# EasyEDA schematic 1-Schematic_RGB project.json
TITLE: Sheet_1; REV: 1.0; Date: 2021-05-16; Sheet: 1/1; Drawn By: saravanan pushpakumar; Company: Your Company
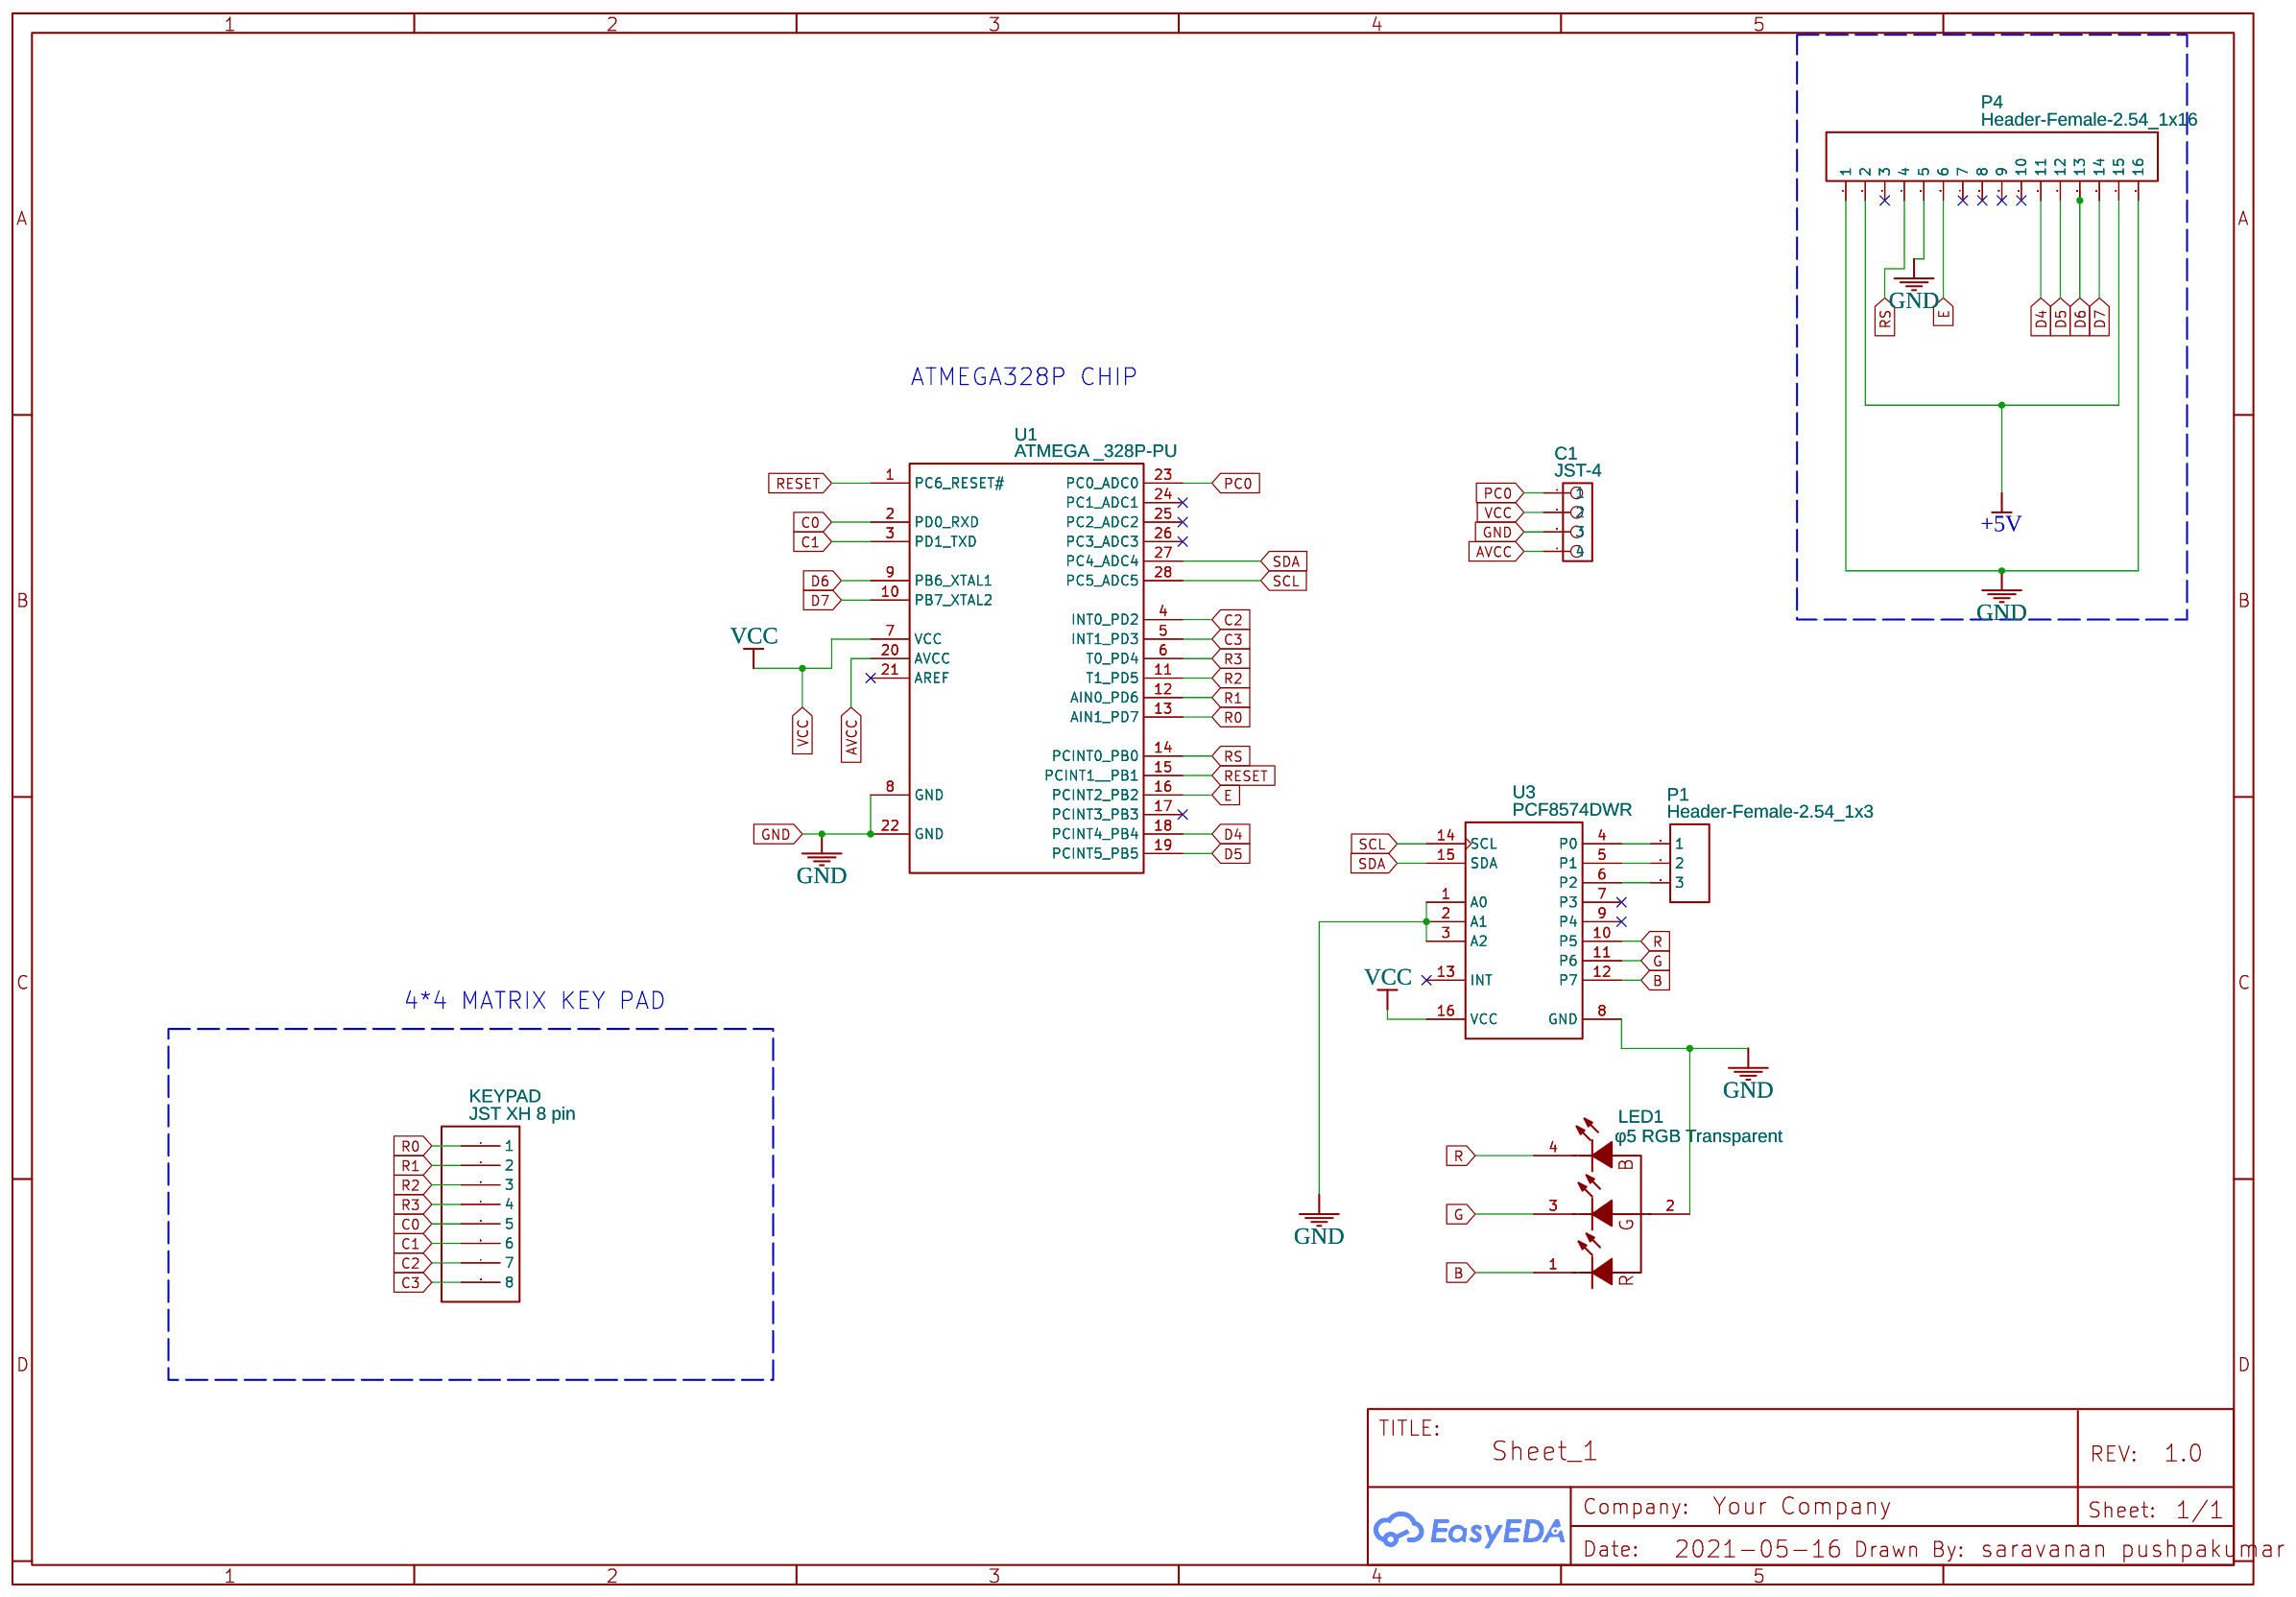
[diagram p0: schematic sheet]

## Parts
C1  JST-4  [JST-4-FEMALE]
KEYPAD  JST XH 8 pin  [JST XH 8]
LED1  φ5 RGB Transparent  [LED-TH_4P-BD5.8-P1.30]
P1  Header-Female-2.54_1x3  [HDR-TH_3P-P2.54-V-F]
P4  Header-Female-2.54_1x16  [HDR-TH_16P-P2.54-V]
U1  ATMEGA _328P-PU  [DIP-28_L34.6-W7.3-P2.54-LS10.2-BL]
U3  PCF8574DWR  [DW16_N]

## Library data of the parts
C1 = JST-4: Manufacturer Part: XH-4A; Supplier Part: XH-4A; Supplier: EasyEDA; Contributor: Beddekhoes dekbedhoes; DataSheet: http://www.jst-mfg.com/product/pdf/eng/eXH.pdf; link: http://www.jst-mfg.com/product/pdf/eng/eXH.pdf
KEYPAD = JST XH 8 pin: Supplier Part: undefined; Contributor: HenryPenton
LED1 = φ5 RGB Transparent: Supplier: LCSC; Manufacturer: KENTO; Manufacturer Part: φ5 RGB Transparent LED; Contributor: LCSC; Supplier Part: C32985
P1 = Header-Female-2.54_1x3: Supplier Part: C146243; Supplier: LCSC; Manufacturer: Boom Precision Elec; link: https://datasheet.lcsc.com/szlcsc/Boom-Precision-Elec-2-54mm-1-8P-Straight-Female-header_C27438.pdf; JLCPCB Part Class: Extended Part
P4 = Header-Female-2.54_1x16: Supplier: LCSC; Manufacturer: BOOMELE; Manufacturer Part: Female header1*16P pitch 2.54mm; image: //image.lceda.cn/szlcsc/C66987.jpg; Supplier Part: C66987; JLCPCB Part Class: Extended Part
U1 = ATMEGA _328P-PU: sourceId: Oic6oiASL; Supplier: LCSC; Manufacturer: MICROCHIP; Manufacturer Part: ATMEGA328P-PU; image: //image.lceda.cn/szlcsc/C33901.jpg; Contributor: LCSC; Supplier Part: C33901
U3 = PCF8574DWR: Remote 8-Bit IO Expander for I2C-Bus, 2.5 to 6 V, -40 to 85 degC, 16-pin SOIC (DW), Green (RoHS  no SbBr)

## Nets
+5V: P4.2 P4.15
AVCC: C1.4 U1.20(AVCC)
GND: C1.3 LED1.2(CA) P4.1 P4.5 P4.16 U1.8(GND) U1.22(GND) U3.1(A0) U3.2(A1) U3.3(A2) U3.8(GND)
VCC: C1.2 U1.7(VCC) U3.16(VCC)
B: LED1.1(KR) U3.12(P7)
C0: KEYPAD.5 U1.2(PD0 RXD)
C1: KEYPAD.6 U1.3(PD1 TXD)
C2: KEYPAD.7 U1.4(INT0 PD2)
C3: KEYPAD.8 U1.5(INT1 PD3)
D4: P4.11 U1.18(PCINT4 PB4)
D5: P4.12 U1.19(PCINT5 PB5)
D6: P4.13 U1.9(PB6 XTAL1)
D7: P4.14 U1.10(PB7 XTAL2)
E: P4.6 U1.16(PCINT2 PB2)
G: LED1.3(KG) U3.11(P6)
PC0: C1.1 U1.23(PC0 ADC0)
R: LED1.4(KB) U3.10(P5)
R0: KEYPAD.1 U1.13(AIN1 PD7)
R1: KEYPAD.2 U1.12(AIN0 PD6)
R2: KEYPAD.3 U1.11(T1 PD5)
R3: KEYPAD.4 U1.6(T0 PD4)
RESET: U1.1(PC6 RESET#) U1.15(PCINT1  PB1)
RS: P4.4 U1.14(PCINT0 PB0)
SCL: U1.28(PC5 ADC5) U3.14(SCL)
SDA: U1.27(PC4 ADC4) U3.15(SDA)
Net-(P1-1): P1.1 U3.4(P0)
Net-(P1-2): P1.2 U3.5(P1)
Net-(P1-3): P1.3 U3.6(P2)

Not connected (* = marked no-connect by the designer): P4 3* 7* 8* 9* 10*; U1 17(PCINT3 PB3)* 21(AREF)* 24(PC1 ADC1)* 25(PC2 ADC2)* 26(PC3 ADC3)*; U3 7(P3)* 9(P4)* 13(INT)*

## Notes on the sheet
- ATMEGA328P CHIP
- 4*4 MATRIX KEY PAD
